# Altium schematic sheet schematic_1.SchDoc
size A3; SheetNumber: 1; SheetTotal: 1
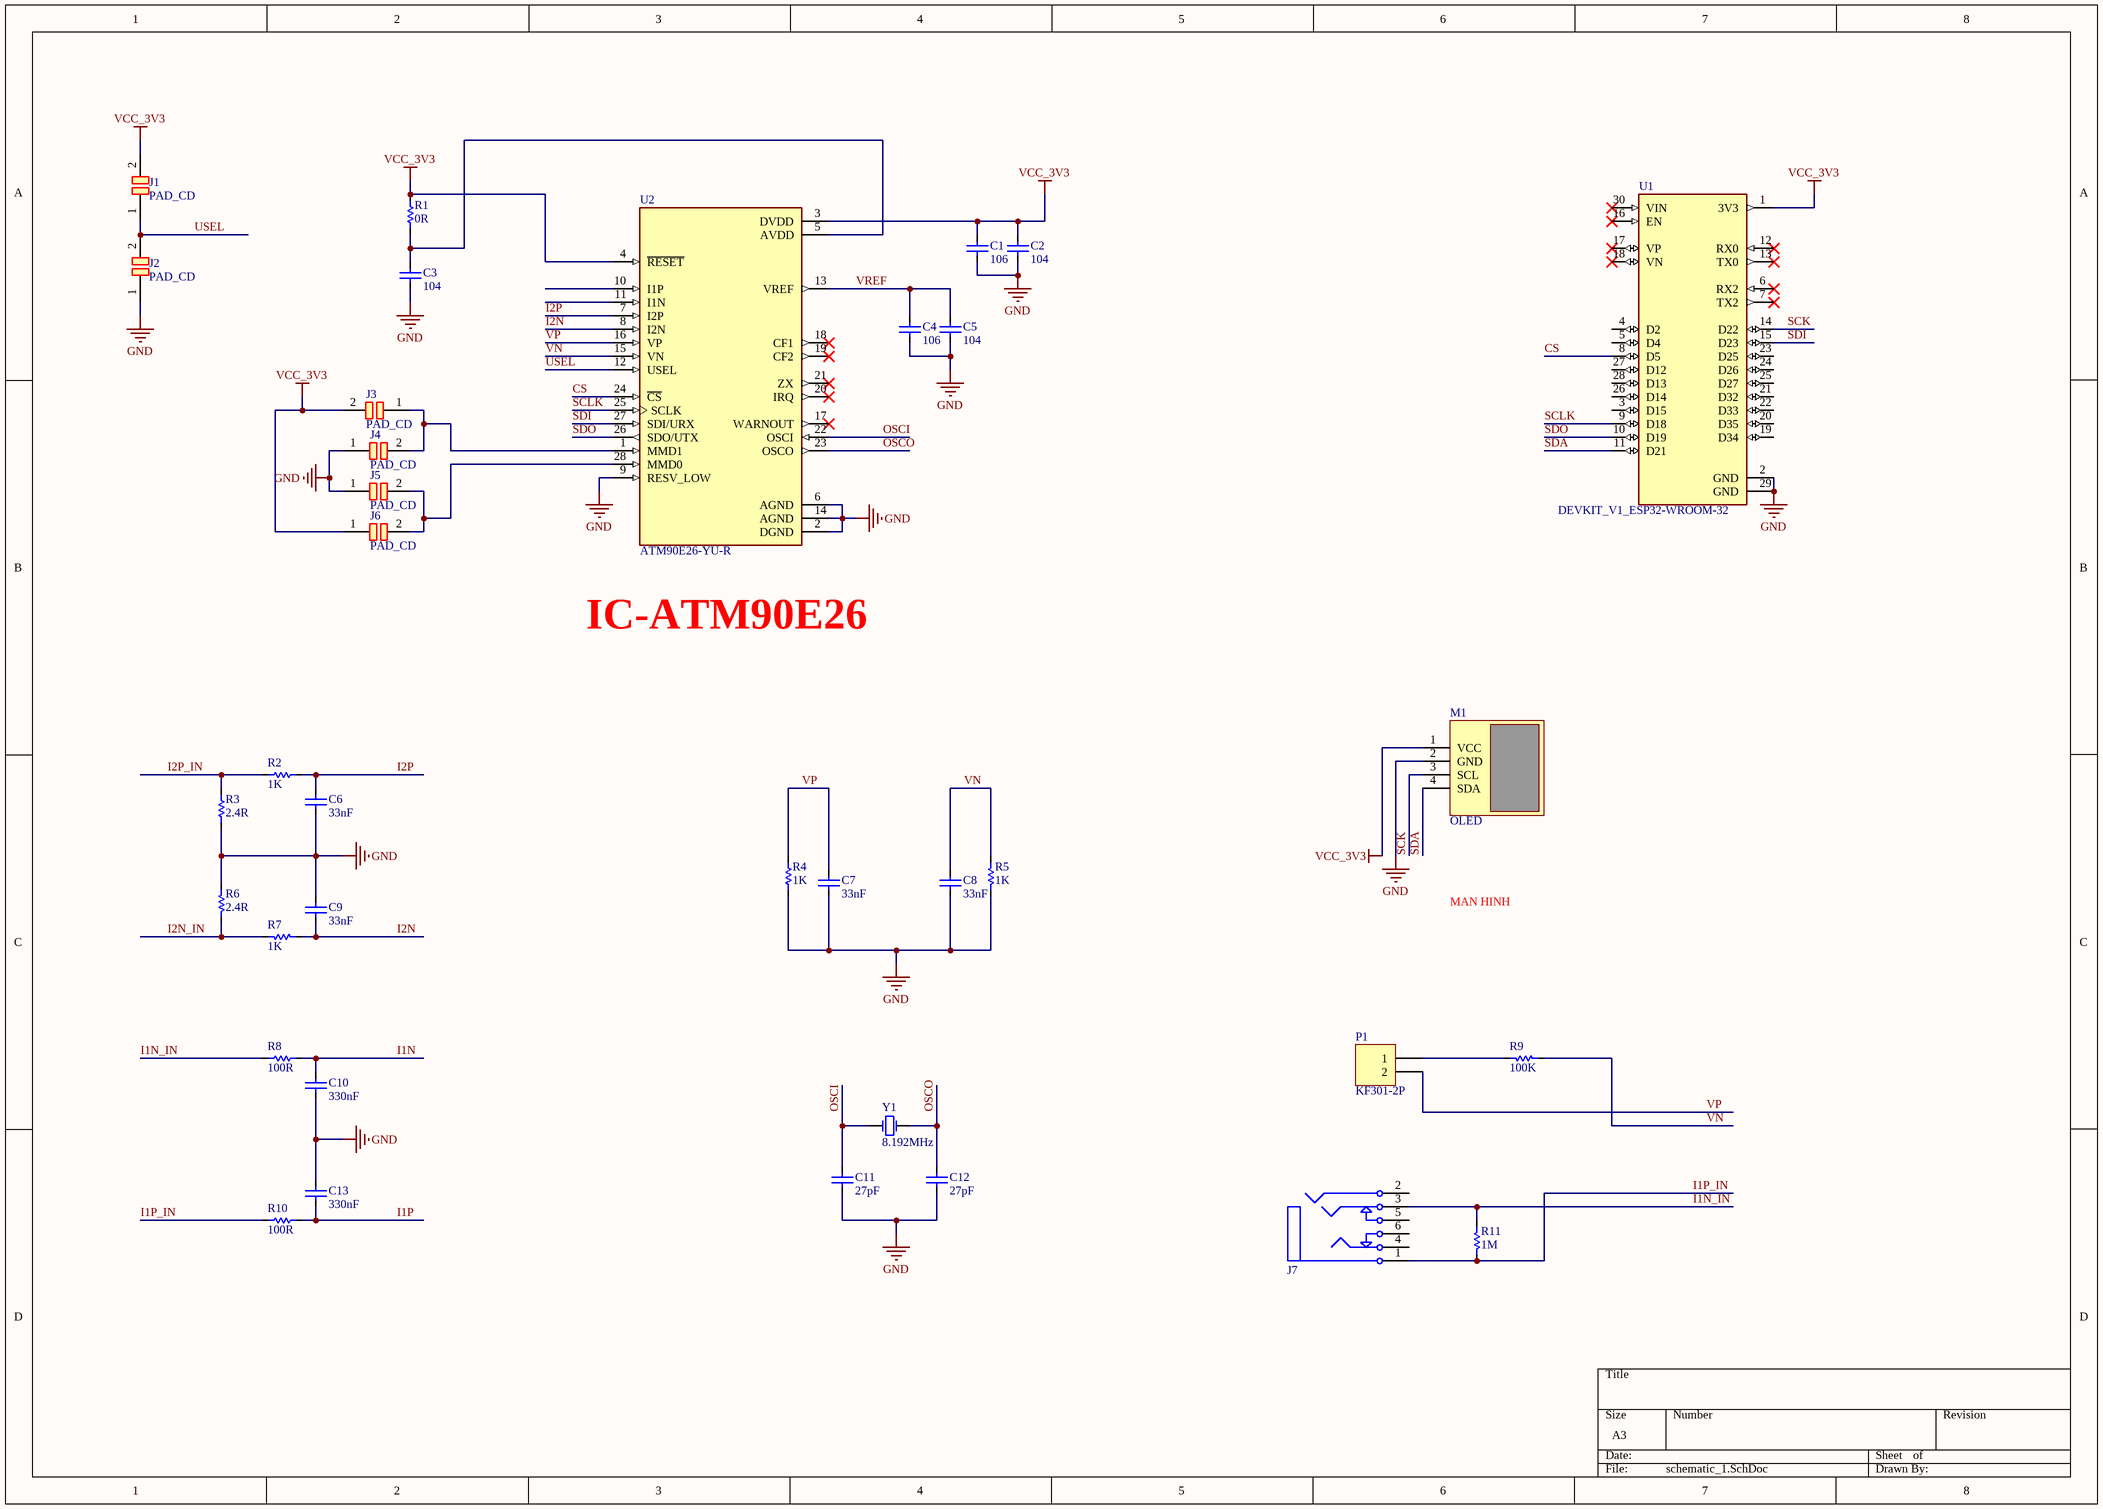
[diagram p0: schematic_1.SchDoc]

## Parts
C1  106  [CAP-1206]
C2  104  [CAP-0805]
C3  104  [CAP-0805]
C4  106  [CAP-1206]
C5  104  [CAP-0805]
C6  33nF  [CAP-0805]
C7  33nF  [CAP-0805]
C8  33nF  [CAP-0805]
C9  33nF  [CAP-0805]
C10  330nF  [CAP-0805]
C11  27pF  [CAP-0805]
C12  27pF  [CAP-0805]
C13  330nF  [CAP-0805]
J1  PAD_CD  [PAD_CD]
J2  PAD_CD  [PAD_CD]
J3  PAD_CD  [PAD_CD]
J4  PAD_CD  [PAD_CD]
J5  PAD_CD  [PAD_CD]
J6  PAD_CD  [PAD_CD]
J7  PJ342  [PJ-342]  (value not drawn)
M1  OLED  [OLED 0.96 I2C]
P1  KF301-2P  [KF301-2P]
R1  0R  [R-0805]
R2  1K  [R-0805]
R3  2.4R  [R-0805]
R4  1K  [R-0805]
R5  1K  [R-0805]
R6  2.4R  [R-0805]
R7  1K  [R-0805]
R8  100R  [R-0805]
R9  100K  [R-0805]
R10  100R  [R-0805]
R11  1M  [R-0805]
U1  DEVKIT_V1_ESP32-WROOM-32  [MODULE_DEVKIT_V1_ESP32-WROOM-32]
U2  ATM90E26-YU-R  [SOP65P780X200-28N]
Y1  8.192MHz  [CRYSTAL-49S]

## Nets
GND: C1.2 C2.2 C3.2 C4.2 C5.2 C6.2 C7.2 C8.2 C9.2 C10.2 C11.2 C12.2 C13.2 J2.1 J4.1 J5.1 M1.2(GND) R3.2 R4.2 R5.2 R6.2 U1.2(GND) U1.29(GND) U2.2(DGND) U2.6(AGND) U2.9(RESV_LOW) U2.14(AGND)
VCC_3V3: C1.1 C2.1 J1.2 J3.2 J6.1 M1.1(VCC) R1.2 U1.1(3V3) U2.3(DVDD) U2.4(~{RESET})
CS: U1.8(D5) U2.24(~{CS})
I1N: C10.1 R8.1
I1N_IN: J7.3 R8.2 R11.2
I1P: C13.1 R10.1
I1P_IN: J7.1 R10.2 R11.1
I2N: C9.1 R7.1 U2.8(I2N)
I2N_IN: R6.1 R7.2
I2P: C6.1 R2.1 U2.7(I2P)
I2P_IN: R2.2 R3.1
OSCI: C11.1 U2.22(OSCI) Y1.1(OSC1)
OSCO: C12.1 U2.23(OSCO) Y1.2(OSC2)
SCK: M1.3(SCL) U1.14(D22)
SCLK: U1.9(D18) U2.25(SCLK)
SDA: M1.4(SDA) U1.11(D21)
SDI: U1.15(D23) U2.27(SDI/URX)
SDO: U1.10(D19) U2.26(SDO/UTX)
USEL: J1.1 J2.2 U2.12(USEL)
VN: C8.1 R5.1 R9.2 U2.15(VN)
VP: C7.1 P1.2 R4.1 U2.16(VP)
VREF: C4.1 C5.1 U2.13(VREF)
NetC3_1: C3.1 R1.1 U2.5(AVDD)
NetJ3_1: J3.1 J4.2 U2.1(MMD1)
NetJ5_2: J5.2 J6.2 U2.28(MMD0)
NetP1_1: P1.1 R9.1

Not connected (* = marked no-connect by the designer): J7 2 4 5 6; U1 3(D15) 4(D2) 5(D4) 6(RX2)* 7(TX2)* 12(RX0)* 13(TX0)* 16(EN)* 17(VP)* 18(VN)* 19(D34) 20(D35) 21(D32) 22(D33) 23(D25) 24(D26) 25(D27) 26(D14) 27(D12) 28(D13) 30(VIN)*; U2 10(I1P) 11(I1N) 17(WARNOUT)* 18(CF1)* 19(CF2)* 20(IRQ)* 21(ZX)*

## Notes on the sheet
- IC-ATM90E26
- MAN HINH

## Library data of the parts
C1 C4 = CAP CER 1206 106 10V: SAPO_NAME: Tụ gốm 106 10V 1206 10uF; SAPO_CODE: 512040; Mounting_Type: Surface_Mount; Value: 106/10V 1206
C2 C3 C5-C13 = CAP CER 0805: *uF *V Ceramic Capacitor 0805 (2012 Metric); Mounting_Type: Surface_Mount; Value: C0805; Processing Cost: *; Price: *; ComponentLink1Description: Linhkienviet; ComponentLink1URL: Linhkienviet
J7 = PJ342-Phone Jack: SAPO_NAME: Jack Audio 3.5MM PJ-342 6P (SMD); SAPO_CODE: 202870; Mounting_Type: Surface_Mount; Price: 2000; Value: PJ342; Parameter 1: *
M1 = OLED 0.96 I2C: Mounting_Type: *; Price: *; Processing Cost: *; SAPO_CODE: *; SAPO_NAME: *; Value: *; ComponentLink1Description: Supplier; ComponentLink1URL: www.www.www; ComponentLink2Description: Document; ComponentLink2URL: www.www.wwww
P1 = KF301-2P: Mounting_Type: Through_Hole; SAPO_CODE: 205300; SAPO_NAME: Header KF301-2p 5.08mm chân tròn; Value: KF301-2P
R1-R11 = R 0805: No Solder Or Re-Calculated; Mounting_Type: Surface_Mount; SAPO_NAME: Điện trở dán 0805 5％ - xxx; Value: R 0805; Price: 80
U1 = DEVKIT_V1_ESP32-WROOM-32: WROOM-32 Development Board ESP32 ESP-32S WiFi Bluetooth Dev Module; MF: Do it; MP: DEVKIT V1 ESP32-WROOM-32; SnapEDA_Link: https://www.snapeda.com/parts/DEVKIT%20V1%20ESP32-WROOM-32/Do+it/view-part/?ref=snap; Package: Package; Value: *; Check_prices: https://www.snapeda.com/parts/DEVKIT%20V1%20ESP32-WROOM-32/Do+it/view-part/?ref=eda
U2 = ATM90E26-YU-R: IC ENERGY METER 1.8V/3V 28SSOP; MF: Microchip; SnapEDA_Link: https://www.snapeda.com/parts/ATM90E26-YU-R/Microchip/view-part/?ref=snap; Package: SSOP-28 Microchip; Value: *; MP: ATM90E26-YU-R; Check_prices: https://www.snapeda.com/parts/ATM90E26-YU-R/Microchip/view-part/?ref=eda
Y1 = CRYSTAL-49S: Crystal 49S Through Hole; Mounting_Type: Through_Hole; Value: Crystal 49S; Processing Cost: *